# Altium project Embeded MCU.PrjPcb
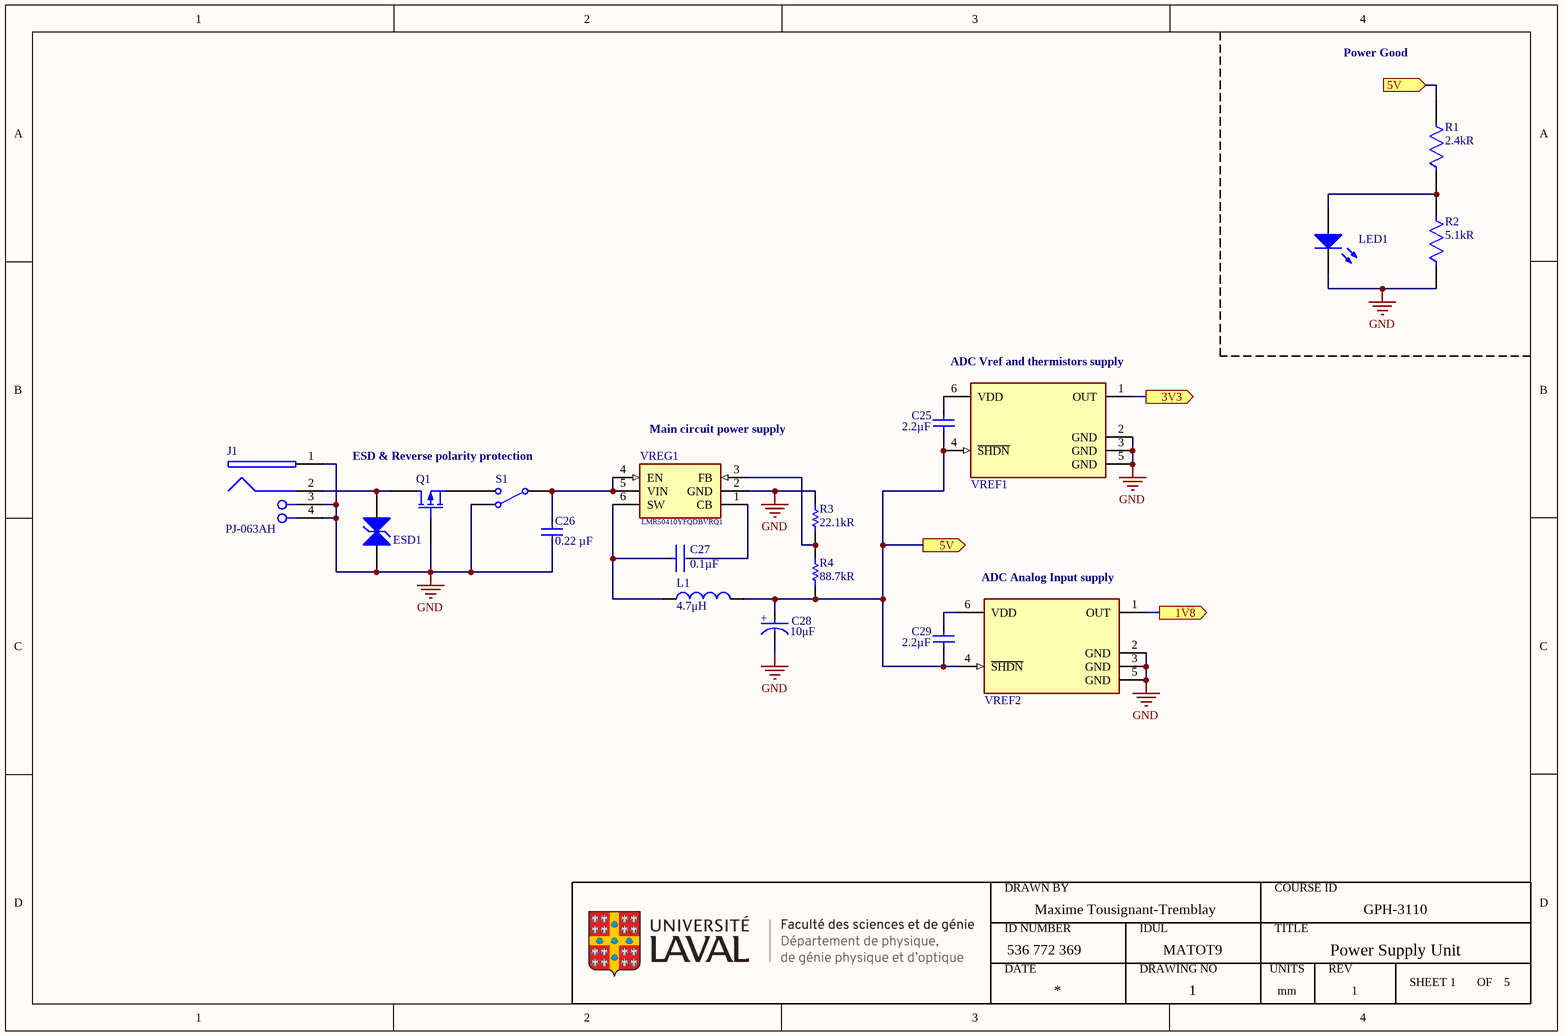
[diagram p0: Power Supply Unit.SchDoc]
Author: Maxime Tousignant-Tremblay; CAGE_CODE: ?????; CONTRACT_NUMBER: <CONTRACT NO>; CourseID: GPH-3110; DOC_NO_ASSY_DWG: <ASSY DWG NO>; DOC_NO_BOM: <BOM DOC NO>; DOC_NO_FAB_DWG: <FAB DWG NO>; DOC_NO_SCH_DWG: <SCH DWG NO>; DrawnBy: =Author; ID Number: 536 772 369; IDUL: MATOT9; PCB_2_DEC_TOL: +/-.01; PCB_3_DEC_TOL: +/-.010; PCB_ANG_TOL: +/-1/2; PCB_ASSEMBLY_NO: <PCB ASSY NO>; PCB_CHECKER: - -----; PCB_CHECKER_APP_DATE: --/--/----; PCB_DESIGNER: - -----; PCB_DESIGNER_APP_DATE: --/--/----; PCB_DWG_NO: <PCB DWG NO>; PCB_ENGINEER: - -----; PCB_ENGINEER_APP_DATE: --/--/----; PCB_PART_NUMBER: <PCB PN>; PCB_REV: A; Revision: 1; SCH_REV: A; Units: mm
5 sheets, 116 parts. Net scope: flat (ports and power ports of the same name join across sheets).
Board file: Embeded MCU.PcbDoc
Sheets:
  Power Supply Unit.SchDoc
  Wheatstone bridge part II.SchDoc
  Wheatstone bridge part I.SchDoc
  Wheatstone bridge part III.SchDoc
  Processing interface.SchDoc

## Sheet Power Supply Unit.SchDoc: Power Supply Unit
size A4; DrawnBy: Maxime Tousignant-Tremblay; DocumentNumber: GPH-3110-1; Revision: 1; SheetNumber: 1; SheetTotal: 5; SPICEModelCacheSEIOAEZJ: <root> / <DocumentId>SEIOAEZJ</DocumentId> / </root>

### Parts
*2  ULaval FSG-DPGPO  (value not drawn)  (graphical)
C25  Capacitance: 2.2µF  [CC0603KRX7R5BB225]  (hidden comment: CC0603KRX7R5BB225)
C26  0.22 µF  [GRM188R71E224KA88D]
C27  Capacitance: 0.1µF  [CAP 0603_1608]
C28  value 10μF  [293D106X9016B2TE3]  (hidden comment: 293D106X9016B2TE3)
C29  Capacitance: 2.2µF  [CC0603KRX7R5BB225]  (hidden comment: CC0603KRX7R5BB225)
ESD1  SMBJ20CA  [SMBJ20CA]  (value not drawn)
J1  PJ-063AH  [PJ-063AH]
L1  value 4.7μH  [ILSB1206ER4R7K]  (hidden comment: ILSB1206ER4R7K)
LED1  151053GS03000  [Type 5mm]  (value not drawn)
Q1  IRLML9303TRPBF  [IRLML9303TRPBF]  (value not drawn)
R1  value 2.4kR  [FP-AC0603-IPC_C]  (hidden comment: AC0603FR-072K4L)
R2  value 5.1kR  [FP-AC0603-IPC_C]  (hidden comment: AC0603FR-075K1L)
R3  value 22.1kR  [CRCW060322K1FKEA-Footprint-2]  (hidden comment: CRCW060322K1FKEA)
R4  value 88.7kR  [FP-CRCW0603-e3-IPC_B]  (hidden comment: CRCW060388K7FKEB)
S1  Single-Pole, Double-Throw Switch  (value not drawn)
VREF1  MCP1501T-33E/CHY  [MCP1501T-33E/CHY]  (value not drawn)
VREF2  MCP1501T-18E/CHY  [MCP1501T-18E/CHY]  (value not drawn)
VREG1  LMR50410YFQDBVRQ1  [LMR50410YFQDBVRQ1]

### Ports
1V8 (out), 3V3 (out), 5V (in), 5V (out)

### Nets
GND: C26.1 C28.1(C) ESD1.2 J1.1 J1.3(SHLD) J1.4(SHLD) LED1.1(K) Q1.2(G) R2.1 R3.2 S1.3 VREF1.2(GND) VREF1.3(GND) VREF1.5(GND) VREF2.2(GND) VREF2.3(GND) VREF2.5(GND) VREG1.2(GND)
NetADC1_1: VREF1.1(OUT) ; port 3V3
NetADC1_2: VREF2.1(OUT) ; port 1V8
NetADC1_9: C25.2 C28.2(A) C29.2 L1.2 R1.2 R4.1 VREF1.4(~{SHDN}) VREF2.4(~{SHDN}) ; port 5V
NetC25_1: C25.1 VREF1.6(VDD)
NetC26_2: C26.2 S1.1 VREG1.4(EN) VREG1.5(VIN)
NetC27_1: C27.1 L1.1 VREG1.6(SW)
NetC27_2: C27.2 VREG1.1(CB)
NetC29_1: C29.1 VREF2.6(VDD)
NetESD1_1: ESD1.1 J1.2 Q1.1(D)
NetLED1_2: LED1.2(A) R1.1 R2.2
NetQ1_3: Q1.3(S) S1.2
NetR3_1: R3.1 R4.2 VREG1.3(FB)

### Notes on the sheet
- Power Good
- (near VREF1) ADC Vref and thermistors supply
- (near VREG1) Main circuit power supply
- ESD & Reverse polarity protection
- (near VREF2) ADC Analog Input supply
- (in symbol 293D106X9016B2TE3) +
- (in symbol ULaval FSG-DPGPO) DRAWN BY; COURSE ID; ID NUMBER; IDUL; TITLE; DATE; DRAWING NO; UNITS; REV; SHEET; OF

### Library data of the parts
C25 C29 = CC0603KRX7R5BB225: 2.2 µF ±10% 6.3V Ceramic Capacitor X7R 0603 (1608 Metric); manufacturer: Yageo; Part Number: CC0603KRX7R5BB225; Applications: General Purpose; componentlink1description: Datasheet; componentlink1url: https://www.yageo.com/upload/media/product/productsearch/datasheet/mlcc/UPY-GPHC_X7R_6.3V-to-50V_18.pdf; componentlink2description: DigiKey Link; componentlink2url: https://www.digikey.com/en/products/detail/yageo/CC0603KRX7R5BB225/5195203; Device Package: 0603 (1608 Metric); lastupdated: 2023-03-06 20:08:32; Lifecycle Status: Active; Minimum Order: 1; Mounting Type: Surface Mount, MLCC; Operating Temperature: -55°C ~ 125°C; Package / Case: 0603 (1608 Metric); packaging: TapeAndReel; partid: 41539; Part Status: Active; price: 0.01; series: CC; Size / Dimension: 0.063" L x 0.031" W (1.60mm x 0.80mm); Temperature Coefficient: X7R; Thickness (Max): 0.035" (0.90mm); Tolerance: ±10%; Voltage - Rated: 6.3V; ComponentLink1Description: Datasheet; ComponentLink1URL: *; Supplier 1: Digi-Key; Supplier Part Number 1: 311-1795-1-ND; Supplier 2: Digi-Key; Supplier Part Number 2: 311-1795-6-ND; Supplier 3: Digi-Key; Supplier Part Number 3: 311-1795-2-ND
C26 = GRM188R71E224KA88D: 0.22 µF ±10% 25V Ceramic Capacitor X7R 0603 (1608 Metric); manufacturer: Murata Electronics; Part Number: GRM188R71E224KA88D; Applications: General Purpose; Capacitance: 0.22 µF; componentlink1description: Datasheet; componentlink1url: https://www.murata.com/~/media/webrenewal/support/library/catalog/products/capacitor/mlcc/c02e.ashx?la=en-us; componentlink2description: DigiKey Link; componentlink2url: https://www.digikey.com/en/products/detail/murata-electronics/GRM188R71E224KA88D/702554; Device Package: 0603 (1608 Metric); lastupdated: 2023-03-05 20:08:17; Lifecycle Status: Active; Minimum Order: 1; Mounting Type: Surface Mount, MLCC; Operating Temperature: -55°C ~ 125°C; Package / Case: 0603 (1608 Metric); packaging: TapeAndReel; partid: 11196; Part Status: Active; price: 0.01; series: GRM; Size / Dimension: 0.063" L x 0.031" W (1.60mm x 0.80mm); Temperature Coefficient: X7R; Thickness (Max): 0.035" (0.90mm); Tolerance: ±10%; Voltage - Rated: 25V; Supplier 1: Digi-Key; Supplier Part Number 1: 490-3290-1-ND; Supplier 2: Digi-Key; Supplier Part Number 2: 490-3290-6-ND; Supplier 3: Digi-Key; Supplier Part Number 3: 490-3290-2-ND; Value: 0.22 µF
C27 = CC0603JRX7R9BB104: 0.1 µF ±5% 50V Ceramic Capacitor X7R 0603 (1608 Metric); manufacturer: Yageo; Part Number: CC0603JRX7R9BB104; Applications: General Purpose; componentlink1description: Datasheet; componentlink1url: https://www.yageo.com/upload/media/product/productsearch/datasheet/mlcc/UPY-GPHC_X7R_6.3V-to-50V_18.pdf; componentlink2description: DigiKey Link; componentlink2url: https://www.digikey.com/en/products/detail/yageo/CC0603JRX7R9BB104/5195188; Device Package: 0603 (1608 Metric); lastupdated: 2023-03-06 20:08:09; Lifecycle Status: Active; Minimum Order: 1; Mounting Type: Surface Mount, MLCC; Operating Temperature: -55°C ~ 125°C; Package / Case: 0603 (1608 Metric); packaging: TapeAndReel; partid: 12474; Part Status: Active; price: 0.01; series: CC; Size / Dimension: 0.063" L x 0.031" W (1.60mm x 0.80mm); Supplier 1: DigiKey; Supplier Part Number 1: 311-1779-1-ND; Temperature Coefficient: X7R; Thickness (Max): 0.035" (0.90mm); Tolerance: ±5%; Voltage - Rated: 50V
C28 = 293D106X9016B2TE3: 10 µF Molded Tantalum Capacitors 16 V 1411 (3528 Metric) 2Ohm; Voltage Rating: 16V; Case Code (Imperial): 1411; Supplier 1: Digi-Key; Supplier Part Number 1: 718-1124-1-ND; Supplier 2: Digi-Key; Supplier Part Number 2: 718-1124-6-ND; Supplier 3: Digi-Key; Supplier Part Number 3: 718-1124-2-ND
ESD1 = SMBJ20CA: 32.4V Clamp 18.6A Ipp Tvs Diode Surface Mount SMB (DO-214AA); Max Power Dissipation: 600W; Diode Type: Zener; Element Configuration: Single; Reverse Standoff Voltage: 20V; Direction: Bidirectional; Max Breakdown Voltage: 25.5V; Min Breakdown Voltage: 22.2V; Max Surge Current: 100A; Peak Pulse Current: 18.6A; ComponentLink1Description: Datasheet; ComponentLink1URL: https://www.bourns.com/docs/Product-Datasheets/SMBJ.pdf; Supplier 1: Digi-Key; Supplier Part Number 1: SMBJ20CABCT-ND; Supplier 2: Digi-Key; Supplier Part Number 2: SMBJ20CABDKR-ND
J1 = PJ-063AH: Power Barrel Connector Jack 2.10mm ID (0.083"), 5.50mm OD (0.217") Through Hole, Right Angle; Current Rating: 8A; Shielding: Shielded; Voltage Rating: 24V; Insulation Resistance: 100MR; Number of Conductors: 2; Supplier 1: Digi-Key; Supplier Part Number 1: CP-063AH-ND; ComponentLink1Description: Datasheet; ComponentLink1URL: https://www.cuidevices.com/product/resource/pj-063ah.pdf; Max Operating Temperature: 85°C; Min Operating Temperature: -25°C; Contact Material: Copper; Contact Plating: Nickel; Flammability Rating: UL94 V-0
L1 = ILSB1206ER4R7K: 4.7 µH Shielded Multilayer Inductor 50 mA 900mOhm Max 1206 (3216 Metric); Tolerance: 10%; Core Material: Ferrite; Self Resonant Frequency: 41MHz; Supplier 1: Digi-Key; Supplier Part Number 1: 541-4372-1-ND; Supplier 2: Digi-Key; Supplier Part Number 2: 541-4372-6-ND; Supplier 3: Digi-Key; Supplier Part Number 3: 541-4372-2-ND; Case Code (Imperial): 1206; Min Operating Temperature: -55°C; Max Operating Temperature: 125°C; Width: 1.6mm; Depth: 1.8mm; Weight: 0.000353oz; ComponentLink1Description: Datasheet; ComponentLink1URL: https://www.vishay.com/docs/34029/ilsb1206.pdf
LED1 = CMP-007-00044-1: Led, Green, T-1 3/4 (5Mm), 522 Nm, 3.4 V, 30 Ma, 10 Cd Rohs Compliant: Yes; Lens Style: Round,Domed,Circular; Viewing Angle: 30°; Lens Transparency: Clear; Luminous Intensity: 10000mcd; Forward Voltage: 3.4V; Dominant Wavelength: 522nm; Forward Current: 30mA; Test Current: 20mA; Lens Color: Colorless; Package Quantity: 1; Height: 8.85mm; RoHS Compliant: Yes; Max Operating Temperature: 85°C; Packaging: Bulk; Wavelength: 522nm; Lens Size: 5mm; Color: Green; Mounting Technology: Through Hole; Series: WL-TMRW; Case/Package: Radial; Min Operating Temperature: -40°C
Q1 = IRLML9303TRPBF: P-Channel 30 V 2.3A (Ta) 1.25W (Ta) Surface Mount Micro3™/SOT-23; Manufacturer: Infineon Technologies; Drain to Source Voltage (Vdss): 30 V; Drive Voltage (Max Rds On,  Min Rds On): 4.5V, 10V; Gate Charge (Qg) (Max) @ Vgs: 2 nC @ 4.5 V; Input Capacitance (Ciss) (Max) @ Vds: 160 pF @ 25 V; Rds On (Max) @ Id, Vgs: 165mOhm @ 2.3A, 10V; Vgs (Max): ±20V; Vgs(th) (Max) @ Id: 2.4V @ 10µA; Part Number: IRLML9303TRPBF; ComponentLink1Description: Datasheet; ComponentLink1URL: https://www.infineon.com/dgdl/irlml9303pbf.pdf?fileId=5546d462533600a401535668ef1d2642; ComponentLink2Description: DigiKey Link; ComponentLink2URL: https://www.digikey.com/en/products/detail/infineon-technologies/IRLML9303TRPBF/2354147; Current - Continuous Drain (Id) @ 25°C: 2.3A (Ta); FET Type: P-Channel; LastUpdated: 2023-03-05 21:05:43; Lifecycle Status: Active; Minimum Order: 1; Mounting Type: Surface Mount; Operating Temperature: -55°C ~ 150°C (TJ); Package / Case: TO-236-3, SC-59, SOT-23-3; Packaging: TapeAndReel; Part Status: Active; Power Dissipation (Max): 1.25W (Ta); Price: 0.11; Series: HEXFET®; Supplier Device Package: Micro3™/SOT-23; Technology: MOSFET (Metal Oxide); Supplier 1: Digi-Key; Supplier Part Number 1: IRLML9303TRPBFCT-ND; Supplier 2: Digi-Key; Supplier Part Number 2: IRLML9303TRPBFDKR-ND; Supplier 3: Digi-Key; Supplier Part Number 3: IRLML9303TRPBFTR-ND
R1 = CMP-009-00195-2: Res Thick Film 0603 2.4K Ohm 1% 0.1W(1/10W) ±100ppm/C Pad SMD Automotive T/R; Power Rating: 100mW; Voltage Rating: 50V; Temperature Coefficient: 100ppm/°C; Termination: SMD/SMT; Case Code (Metric): 1608; Number of Terminations: 2; Min Operating Temperature: -55°C; Width: 0.8mm; Length: 0.063inch; Tolerance: 1%; Height: 0.022inch; Case Code (Imperial): 0603; Max Operating Temperature: 155°C; Weight: 7.1E-05oz; Packaging: Tape and Reel; Resistor Type: Thick Film; Case/Package: 0603; Ratings: AEC-Q200; RoHS Compliant: Yes; Features: Moisture Resistant,Automotive AEC-Q200; Max Power Dissipation: 100mW; Series: AC
R2 = CMP-009-00196-1: Res Thick Film 0603 5.1K Ohm 1% 1/10W ±100ppm/°C Molded SMD Paper T/R; Voltage Rating: 50V; Power Rating: 100mW; Case/Package: 0603; Case Code (Imperial): 0603; Ratings: AEC-Q200; Width: 0.8mm; Tolerance: 1%; Max Operating Temperature: 155°C; Number of Terminations: 2; Case Code (Metric): 1608; Resistor Type: Thick Film; Packaging: Tape and Reel; RoHS Compliant: Yes; Min Operating Temperature: -55°C; Height: 0.45mm; Series: AC; Max Power Dissipation: 100mW; Weight: 7.1E-05oz; Features: Moisture Resistant,Automotive AEC-Q200; Termination: SMD/SMT; Length: 1.6mm; Temperature Coefficient: 100ppm/°C
R3 = CMP-009-00200-2: Res Thick Film 0603 22.1K Ohm 1% 1/10W ±100ppm/°C Molded SMD SMD Paper T/R; Voltage Rating (DC): 75V; Max Power Dissipation: 100mW; Number of Terminations: 2; Tolerance: 1%; Construction: Rectangular; Packaging: Tape and Reel; Case Code (Imperial): 0603; Termination: SMD/SMT; Series: CRCW; Temperature Coefficient: 100ppm/°C; Depth: 0.85mm; Military Standard: Not; Height: 0.45mm; Weight: 7.1E-05oz; Package Quantity: 10; Radiation Hardening: No; Width: 0.033inch; Case Code (Metric): 1608; Mounting Technology: Surface Mount; Min Operating Temperature: -55°C; Voltage Rating: 75V; RoHS Compliant: Yes; Case/Package: 0603; Max Operating Temperature: 155°C; Lead Free: Lead Free; Contact Plating: Tin; Resistance Tolerance: 1%; Resistor Type: Thick Film; Power Rating: 100mW; Ratings: AEC-Q200; Features: Automotive AEC-Q200; Technology: THICK FILM; Length: 1.55mm
R4 = CMP-009-00199-2: D11/CRCW0603 100 88K7 1% ET5 e3; Max Power Dissipation: 100mW; Voltage Rating: 75V; Temperature Coefficient: 100ppm/°C; RoHS Compliant: Yes; Min Operating Temperature: -55°C; Packaging: Tape and Reel; Weight: 7.1E-05oz; Military Standard: Not; Case Code (Metric): 1608; Tolerance: 1%; Power Rating: 100mW; Resistor Type: Thick Film; Features: Automotive AEC-Q200; Construction: Rectangular; Length: 0.061inch; Case/Package: 0603; Number of Terminations: 2; Lead Free: Lead Free; Width: 0.85mm; Max Operating Temperature: 155°C; Package Quantity: 10000; Height: 0.02inch; Depth: 0.85mm; Termination: SMD/SMT; Case Code (Imperial): 0603; Series: CRCW
S1 = SPDT SW: nodeUP_closed: 1; Rclosed: 1m; Ropen: 1Meg; SimulationGenericComponent: True
VREF1 = MCP1501T-33E/CHY: Series Voltage Reference IC Fixed 3.3V V ±0.1% 20 mA SOT-23-6; Temperature Coefficient: 50ppm/°C; Output Current: 20mA; Tolerance: 0.08%; Operating Supply Current: 550μA; ComponentLink1Description: New link; ComponentLink1URL: *; Reference Type: Series; Case/Package: SOT-23-6; Output Type: Fixed; Min Output Voltage: 3.3V; Min Operating Temperature: -40°C; Max Operating Temperature: 125°C; Supplier 1: Digi-Key; Supplier Part Number 1: MCP1501T-33E/CHYCT-ND; Supplier 2: Digi-Key; Supplier Part Number 2: MCP1501T-33E/CHYDKR-ND; Supplier 3: Digi-Key; Supplier Part Number 3: MCP1501T-33E/CHYTR-ND
VREF2 = MCP1501T-18E/CHY: Series Voltage Reference IC Fixed 31.8V V ±0.1% 20 mA SOT-23-6; Temperature Coefficient: 50ppm/°C; Output Current: 20mA; Min Output Voltage: 1.8V; Tolerance: 0.08%; Operating Supply Current: 550μA; ComponentLink1Description: New link; ComponentLink1URL: *; Reference Type: Series; Case/Package: SOT-23-6; Output Type: Fixed; Min Operating Temperature: -40°C; Max Operating Temperature: 125°C; Supplier 1: Digi-Key; Supplier Part Number 1: MCP1501T-18E/CHYCT-ND; Supplier 2: Digi-Key; Supplier Part Number 2: MCP1501T-18E/CHYDKR-ND
VREG1 = LMR50410YFQDBVRQ1: Buck Switching Regulator IC Positive Adjustable 1V 1 Output 1A SOT-23-6; Manufacturer_Name: Texas Instruments; Datasheet Link: https://www.ti.com/product/LMR50410-Q1; Height: 1.45mm; Manufacturer_Part_Number: LMR50410YFQDBVRQ1; Mouser Part Number: 595-MR50410YFQDBVRQ1; Mouser Price/Stock: https://www.mouser.co.uk/ProductDetail/Texas-Instruments/LMR50410YFQDBVRQ1?qs=81r%252BiQLm7BRUAgUFqYZycA%3D%3D; Arrow Part Number: LMR50410YFQDBVRQ1; Arrow Price/Stock: https://www.arrow.com/en/products/lmr50410yfqdbvrq1/texas-instruments?region=nac; Supplier 1: Digi-Key; Supplier Part Number 1: 296-LMR50410YFQDBVRQ1CT-ND; Supplier 2: Digi-Key; Supplier Part Number 2: 296-LMR50410YFQDBVRQ1DKR-ND; Supplier 3: Digi-Key; Supplier Part Number 3: 296-LMR50410YFQDBVRQ1TR-ND

## Sheet Wheatstone bridge part II.SchDoc: Wheatstone bridge part II
size A4; Revision: 1; SheetNumber: 2; SheetTotal: 5
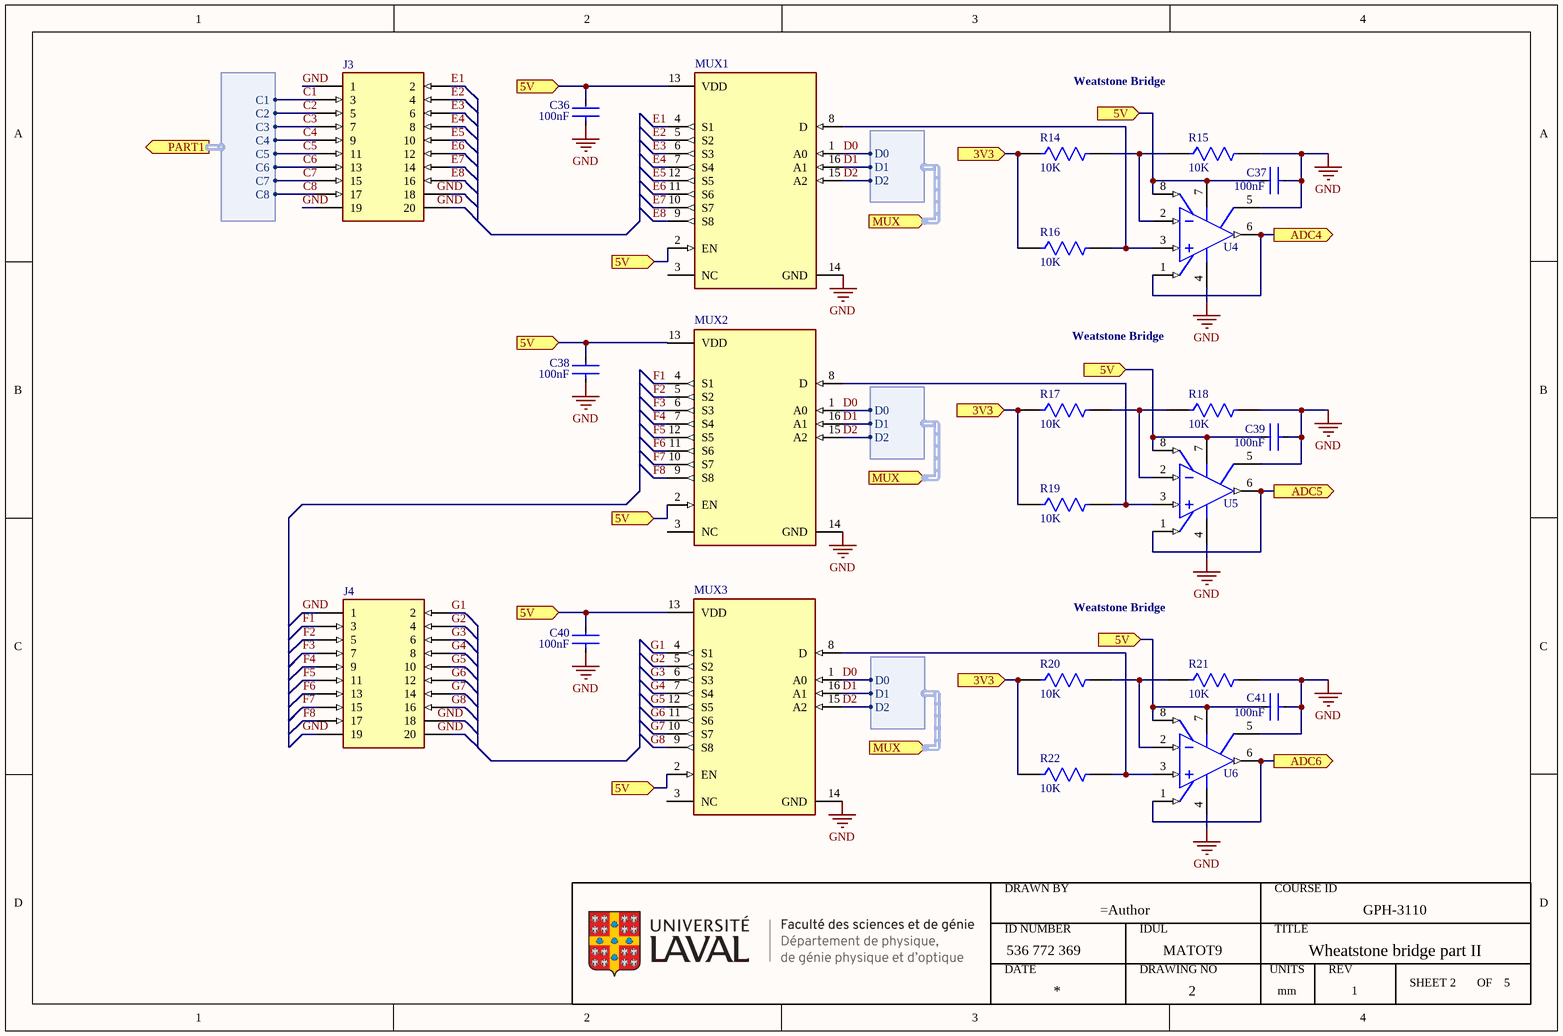
[diagram p1: Wheatstone bridge part II.SchDoc]

### Parts
*4  ULaval FSG-DPGPO  (value not drawn)  (graphical)
C36  value 100nF  [FP-CC0603-DA-IPC_B]  (hidden comment: CC0603JRX7R9BB104)
C37  value 100nF  [FP-CC0603-DA-IPC_B]  (hidden comment: CC0603JRX7R9BB104)
C38  value 100nF  [FP-CC0603-DA-IPC_B]  (hidden comment: CC0603JRX7R9BB104)
C39  value 100nF  [FP-CC0603-DA-IPC_B]  (hidden comment: CC0603JRX7R9BB104)
C40  value 100nF  [FP-CC0603-DA-IPC_B]  (hidden comment: CC0603JRX7R9BB104)
C41  value 100nF  [FP-CC0603-DA-IPC_B]  (hidden comment: CC0603JRX7R9BB104)
J3  SFC-110-T1-F-D-A  [SFC-110-T1-F-D-A-Footprint-2]  (value not drawn)
J4  SFC-110-T1-F-D-A  [SFC-110-T1-F-D-A-Footprint-2]  (value not drawn)
MUX1  TMUX1208PWR  [TMUX1208PWR]  (value not drawn)
MUX2  TMUX1208PWR  [TMUX1208PWR]  (value not drawn)
MUX3  TMUX1208PWR  [TMUX1208PWR]  (value not drawn)
R14  value 10K  [FP-RT0603-IPC_B]  (hidden comment: RT0603BRD0710KL)
R15  value 10K  [FP-RT0603-IPC_B]  (hidden comment: RT0603BRD0710KL)
R16  value 10K  [FP-RT0603-IPC_B]  (hidden comment: RT0603BRD0710KL)
R17  value 10K  [FP-RT0603-IPC_B]  (hidden comment: RT0603BRD0710KL)
R18  value 10K  [FP-RT0603-IPC_B]  (hidden comment: RT0603BRD0710KL)
R19  value 10K  [FP-RT0603-IPC_B]  (hidden comment: RT0603BRD0710KL)
R20  value 10K  [FP-RT0603-IPC_B]  (hidden comment: RT0603BRD0710KL)
R21  value 10K  [FP-RT0603-IPC_B]  (hidden comment: RT0603BRD0710KL)
R22  value 10K  [FP-RT0603-IPC_B]  (hidden comment: RT0603BRD0710KL)
U4  MCP6N11-100E/SN  [MCP6N11-100E/SN]  (value not drawn)
U5  MCP6N11-100E/SN  [MCP6N11-100E/SN]  (value not drawn)
U6  MCP6N11-100E/SN  [MCP6N11-100E/SN]  (value not drawn)

### Ports
3V3 (in), 5V (in), ADC4 (out), ADC5 (out), ADC6 (out), MUX (in, harness *), PART1 (out, harness J3)

### Harnesses
*: D0, D1, D2
J3: C1, C2, C3, C4, C5, C6, C7, C8

### Nets
GND: C36.1 C37.1 C38.1 C39.1 C40.1 C41.1 J3.1 J3.18 J3.19 J3.20 J4.1 J4.18 J4.19 J4.20 MUX1.14(GND) MUX2.14(GND) MUX3.14(GND) R15.2 R18.2 R21.2 U4.4(VSS) U4.5(VREF) U5.4(VSS) U5.5(VREF) U6.4(VSS) U6.5(VREF)
C1: J3.3 ; port PART1.C1
C2: J3.5 ; port PART1.C2
C3: J3.7 ; port PART1.C3
C4: J3.9 ; port PART1.C4
C5: J3.11 ; port PART1.C5
C6: J3.13 ; port PART1.C6
C7: J3.15 ; port PART1.C7
C8: J3.17 ; port PART1.C8
D0: MUX1.1(A0) MUX2.1(A0) MUX3.1(A0) ; port MUX.D0
D1: MUX1.16(A1) MUX2.16(A1) MUX3.16(A1) ; port MUX.D1
D2: MUX1.15(A2) MUX2.15(A2) MUX3.15(A2) ; port MUX.D2
E1: J3.2 MUX1.4(S1)
E2: J3.4 MUX1.5(S2)
E3: J3.6 MUX1.6(S3)
E4: J3.8 MUX1.7(S4)
E5: J3.10 MUX1.12(S5)
E6: J3.12 MUX1.11(S6)
E7: J3.14 MUX1.10(S7)
E8: J3.16 MUX1.9(S8)
F1: J4.3 MUX2.4(S1)
F2: J4.5 MUX2.5(S2)
F3: J4.7 MUX2.6(S3)
F4: J4.9 MUX2.7(S4)
F5: J4.11 MUX2.12(S5)
F6: J4.13 MUX2.11(S6)
F7: J4.15 MUX2.10(S7)
F8: J4.17 MUX2.9(S8)
G1: J4.2 MUX3.4(S1)
G2: J4.4 MUX3.5(S2)
G3: J4.6 MUX3.6(S3)
G4: J4.8 MUX3.7(S4)
G5: J4.10 MUX3.12(S5)
G6: J4.12 MUX3.11(S6)
G7: J4.14 MUX3.10(S7)
G8: J4.16 MUX3.9(S8)
NetADC1_1: R14.1 R16.1 R17.1 R19.1 R20.1 R22.1 ; port 3V3
NetADC1_9: C36.2 C37.2 C38.2 C39.2 C40.2 C41.2 MUX1.2(EN) MUX1.13(VDD) MUX2.2(EN) MUX2.13(VDD) MUX3.2(EN) MUX3.13(VDD) U4.7(VDD) U4.8(EN/~{CAL}) U5.7(VDD) U5.8(EN/~{CAL}) U6.7(VDD) U6.8(EN/~{CAL}) ; port 5V
NetADC4_3: U4.1(VFG) U4.6(VOUT) ; port ADC4
NetADC5_3: U5.1(VFG) U5.6(VOUT) ; port ADC5
NetADC6_3: U6.1(VFG) U6.6(VOUT) ; port ADC6
NetMUX1_8: MUX1.8(D) R16.2 U4.3(VIP)
NetMUX2_8: MUX2.8(D) R19.2 U5.3(VIP)
NetMUX3_8: MUX3.8(D) R22.2 U6.3(VIP)
NetR14_2: R14.2 R15.1 U4.2(VIM)
NetR17_2: R17.2 R18.1 U5.2(VIM)
NetR20_2: R20.2 R21.1 U6.2(VIM)

Not connected (* = marked no-connect by the designer): MUX1 3(NC); MUX2 3(NC); MUX3 3(NC)

### Notes on the sheet
- Weatstone Bridge
- (in symbol ULaval FSG-DPGPO) DRAWN BY; COURSE ID; ID NUMBER; IDUL; TITLE; DATE; DRAWING NO; UNITS; REV; SHEET; OF

### Library data of the parts
C36-C41 = CMP-001-00097-1: 0603 0.1 uF 50 V ±5 % Tolerance X7R SMT Multilayer Ceramic Capacitor; Voltage Rating: 50V; Tolerance: 5%; Halogen Free: Halogen Free; Depth: 0.8mm; Case/Package: 0603; Dielectric: X7R; Thickness: 0.035inch; Series: CC; Termination: SMD/SMT; Voltage Rating (DC): 50V; Max Operating Temperature: 125°C; Weight: 7.1E-05oz; Construction: Flat; Resistor Type: Ceramic; Height: 0.8mm; Length: 0.063inch; RoHS Compliant: Yes; Lead Free: Lead Free; Pins: 2; Min Operating Temperature: -55°C; Case Code (Imperial): 0603; Radiation Hardening: No; Case Code (Metric): 1608; Mounting Technology: Surface Mount; Width: 0.031inch; Packaging: Tape and Reel
J3 J4 = CMP-002-00080-2: Headers & Wire Housings .050 Tiger Eye Cost-Effective Reliable Socket Strip; Pitch: 0.05inch; Voltage Rating (AC): 350V; Connector Type: Receptacle; Number of Contacts: 20; Gender: Female; Insulation Color: Black; Max Operating Temperature: 125°C; Min Operating Temperature: -55°C; Insulation Material: Polymer; RoHS Compliant: Yes; Row Spacing: 0.05inch; Number of Rows: 2; Contact Shape: Square; Contact Type: Female Socket; Mounting Technology: Through Hole; Termination: Solder; Fastening Type: Pull; Contact Finish - Mating: GOLD; Color: Black; Packaging: Rail/Tube; Contact Material: Bronze; Contact Plating: Gold; Number of Positions: 20; Series: Tiger Eye™ SFC
MUX1-MUX3 = TMUX1208PWR: 5-V, 8: 1, 1-channel general-purpose analog multiplexer with 1.8-V input logic 16-TSSOP -40 to 125; Supplier 1: Digi-Key; Supplier Part Number 1: 296-51847-1-ND; Supplier 2: Digi-Key; Supplier Part Number 2: 296-51847-6-ND; Supplier 3: Digi-Key; Supplier Part Number 3: 296-51847-2-ND; ComponentLink1Description: Datasheet; ComponentLink1URL: https://www.ti.com/lit/ds/symlink/tmux1208.pdf?HQS=dis-dk-null-digikeymode-dsf-pf-null-wwe&ts=1678139087624&ref_url=https%253A%252F%252Fwww.ti.com%252Fgeneral%252Fdocs%252Fsuppproductinfo.tsp%253FdistId%253D10%2526gotoUrl%253Dhttps%253A%252F%252Fwww.ti.com%252Flit%252Fgpn%252Ftmux1208
R14-R22 = CMP-009-00178-1: Res High precision Thin Film 0603 10K Ohm 0.1% 1/10W ±25ppm/°C Molded SMD Paper T/R; Max Power Dissipation: 100mW; Working Voltage: 75V; RoHS Compliant: Yes; Power Rating: 100mW; Lead Free: Lead Free; Depth: 0.8mm; Case Code (Imperial): 0603; Max Operating Temperature: 155°C; Voltage Rating: 75V; Package Quantity: 5000; Packaging: Tape and Reel; Case/Package: 0603; Height: 0.022inch; Construction: Rectangular; Min Operating Temperature: -55°C; Termination: SMD/SMT; Features: Moisture Resistant; Number of Terminations: 2; Case Code (Metric): 1608; Technology: THIN FILM; Military Standard: Not; Length: 0.063inch; Voltage Rating (DC): 75V; Temperature Coefficient: 25ppm/°C; Weight: 7.1E-05oz; Width: 0.8mm; Series: RT; Resistor Type: Thin Film
U4-U6 = CMP-014-00010-7: MCP6N11 Series Single Channel 500 KHz 5.5 V Instrumentation Amplifier - SOIC-8; Bandwidth: 500kHz; Min Supply Voltage: 1.8V; Number of Elements: 2; Gain Bandwidth Product: 35MHz; Input Offset Voltage (Vos): 350uV; Number of Channels: 1; Nominal Supply Current: 800uA; Common Mode Rejection Ratio: 86dB; Slew Rate: 6V/µs; Max Supply Voltage: 5.5V; Slew Rate-Nom: 9V/µs; Input Bias Current: 10pA; Mounting Technology: Surface Mount; Package Quantity: 100; Pins: 8; Width: 3.9mm; Length: 4.9mm; Case/Package: SOIC; Min Operating Temperature: -40°C; Radiation Hardening: No; RoHS Compliant: Yes; Unity Gain Bandwidth Product: 35MHz; Lead Free: Lead Free; Number of Amplifiers: 1; Max Operating Temperature: 125°C; Height: 1.25mm; Packaging: Rail/Tube; Input Offset Voltage-Max: 350uV; Reach SVHC Compliant: Yes; Supply Current: 800uA; Max Supply Current: 800uA; Power Supply Rejection Ratio (PSRR): 86dB; Number of Circuits: 1

## Sheet Wheatstone bridge part I.SchDoc: Wheatstone bridge part I
size A4; Revision: 1; SheetNumber: 3; SheetTotal: 5
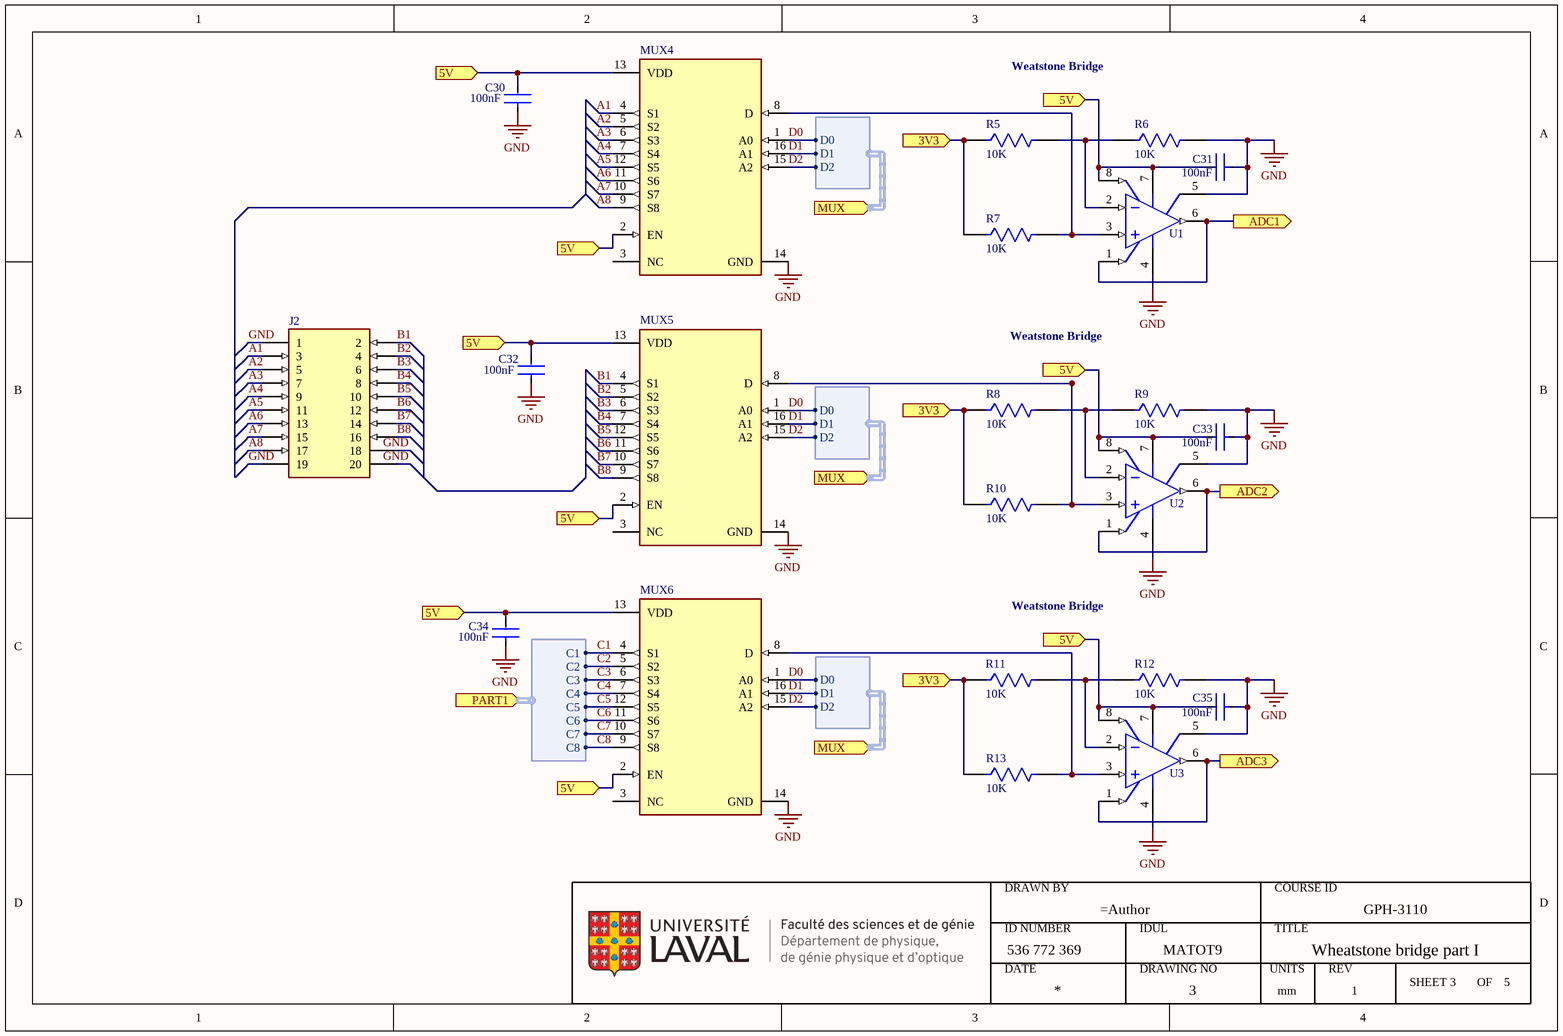
[diagram p2: Wheatstone bridge part I.SchDoc]

### Parts
*3  ULaval FSG-DPGPO  (value not drawn)  (graphical)
C30  value 100nF  [FP-CC0603-DA-IPC_B]  (hidden comment: CC0603JRX7R9BB104)
C31  value 100nF  [FP-CC0603-DA-IPC_B]  (hidden comment: CC0603JRX7R9BB104)
C32  value 100nF  [FP-CC0603-DA-IPC_B]  (hidden comment: CC0603JRX7R9BB104)
C33  value 100nF  [FP-CC0603-DA-IPC_B]  (hidden comment: CC0603JRX7R9BB104)
C34  value 100nF  [FP-CC0603-DA-IPC_B]  (hidden comment: CC0603JRX7R9BB104)
C35  value 100nF  [FP-CC0603-DA-IPC_B]  (hidden comment: CC0603JRX7R9BB104)
J2  SFC-110-T1-F-D-A  [SFC-110-T1-F-D-A-Footprint-2]  (value not drawn)
MUX4  TMUX1208PWR  [TMUX1208PWR]  (value not drawn)
MUX5  TMUX1208PWR  [TMUX1208PWR]  (value not drawn)
MUX6  TMUX1208PWR  [TMUX1208PWR]  (value not drawn)
R5  value 10K  [FP-RT0603-IPC_B]  (hidden comment: RT0603BRD0710KL)
R6  value 10K  [FP-RT0603-IPC_B]  (hidden comment: RT0603BRD0710KL)
R7  value 10K  [FP-RT0603-IPC_B]  (hidden comment: RT0603BRD0710KL)
R8  value 10K  [FP-RT0603-IPC_B]  (hidden comment: RT0603BRD0710KL)
R9  value 10K  [FP-RT0603-IPC_B]  (hidden comment: RT0603BRD0710KL)
R10  value 10K  [FP-RT0603-IPC_B]  (hidden comment: RT0603BRD0710KL)
R11  value 10K  [FP-RT0603-IPC_B]  (hidden comment: RT0603BRD0710KL)
R12  value 10K  [FP-RT0603-IPC_B]  (hidden comment: RT0603BRD0710KL)
R13  value 10K  [FP-RT0603-IPC_B]  (hidden comment: RT0603BRD0710KL)
U1  MCP6N11-100E/SN  [MCP6N11-100E/SN]  (value not drawn)
U2  MCP6N11-100E/SN  [MCP6N11-100E/SN]  (value not drawn)
U3  MCP6N11-100E/SN  [MCP6N11-100E/SN]  (value not drawn)

### Ports
3V3 (in), 5V (in), ADC1 (out), ADC2 (out), ADC3 (out), MUX (in, harness *), PART1 (in, harness J2)

### Harnesses
*: D0, D1, D2
J2: C1, C2, C3, C4, C5, C6, C7, C8

### Nets
GND: C30.1 C31.1 C32.1 C33.1 C34.1 C35.1 J2.1 J2.18 J2.19 J2.20 MUX4.14(GND) MUX5.14(GND) MUX6.14(GND) R6.2 R9.2 R12.2 U1.4(VSS) U1.5(VREF) U2.4(VSS) U2.5(VREF) U3.4(VSS) U3.5(VREF)
A1: J2.3 MUX4.4(S1)
A2: J2.5 MUX4.5(S2)
A3: J2.7 MUX4.6(S3)
A4: J2.9 MUX4.7(S4)
A5: J2.11 MUX4.12(S5)
A6: J2.13 MUX4.11(S6)
A7: J2.15 MUX4.10(S7)
A8: J2.17 MUX4.9(S8)
B1: J2.2 MUX5.4(S1)
B2: J2.4 MUX5.5(S2)
B3: J2.6 MUX5.6(S3)
B4: J2.8 MUX5.7(S4)
B5: J2.10 MUX5.12(S5)
B6: J2.12 MUX5.11(S6)
B7: J2.14 MUX5.10(S7)
B8: J2.16 MUX5.9(S8)
C1: MUX6.4(S1) ; port PART1.C1
C2: MUX6.5(S2) ; port PART1.C2
C3: MUX6.6(S3) ; port PART1.C3
C4: MUX6.7(S4) ; port PART1.C4
C5: MUX6.12(S5) ; port PART1.C5
C6: MUX6.11(S6) ; port PART1.C6
C7: MUX6.10(S7) ; port PART1.C7
C8: MUX6.9(S8) ; port PART1.C8
D0: MUX4.1(A0) MUX5.1(A0) MUX6.1(A0) ; port MUX.D0
D1: MUX4.16(A1) MUX5.16(A1) MUX6.16(A1) ; port MUX.D1
D2: MUX4.15(A2) MUX5.15(A2) MUX6.15(A2) ; port MUX.D2
NetADC1_1: R5.1 R7.1 R8.1 R10.1 R11.1 R13.1 ; port 3V3
NetADC1_3: U1.1(VFG) U1.6(VOUT) ; port ADC1
NetADC1_9: C30.2 C31.2 C32.2 C33.2 C34.2 C35.2 MUX4.2(EN) MUX4.13(VDD) MUX5.2(EN) MUX5.13(VDD) MUX6.2(EN) MUX6.13(VDD) U1.7(VDD) U1.8(EN/~{CAL}) U2.7(VDD) U2.8(EN/~{CAL}) U3.7(VDD) U3.8(EN/~{CAL}) ; port 5V
NetADC2_3: U2.1(VFG) U2.6(VOUT) ; port ADC2
NetADC3_3: U3.1(VFG) U3.6(VOUT) ; port ADC3
NetMUX4_8: MUX4.8(D) R7.2 U1.3(VIP)
NetMUX5_8: MUX5.8(D) R10.2 U2.3(VIP)
NetMUX6_8: MUX6.8(D) R13.2 U3.3(VIP)
NetR5_2: R5.2 R6.1 U1.2(VIM)
NetR8_2: R8.2 R9.1 U2.2(VIM)
NetR11_2: R11.2 R12.1 U3.2(VIM)

Not connected (* = marked no-connect by the designer): MUX4 3(NC); MUX5 3(NC); MUX6 3(NC)

### Notes on the sheet
- Weatstone Bridge
- (in symbol ULaval FSG-DPGPO) DRAWN BY; COURSE ID; ID NUMBER; IDUL; TITLE; DATE; DRAWING NO; UNITS; REV; SHEET; OF

### Library data of the parts
C30-C35 = CMP-001-00097-1: as C36 on sheet Wheatstone bridge part II; Halogen Free: Halogen Free; Depth: 0.8mm; Case/Package: 0603; Dielectric: X7R; Thickness: 0.035inch; Series: CC; Termination: SMD/SMT; Voltage Rating (DC): 50V; Max Operating Temperature: 125°C; Weight: 7.1E-05oz; Construction: Flat; Resistor Type: Ceramic; Height: 0.8mm; Length: 0.063inch; RoHS Compliant: Yes; Lead Free: Lead Free; Pins: 2; Min Operating Temperature: -55°C; Case Code (Imperial): 0603; Radiation Hardening: No; Case Code (Metric): 1608; Mounting Technology: Surface Mount; Width: 0.031inch; Packaging: Tape and Reel
J2 = CMP-002-00080-2: as J3 on sheet Wheatstone bridge part II; Insulation Color: Black; Max Operating Temperature: 125°C; Min Operating Temperature: -55°C; Insulation Material: Polymer; RoHS Compliant: Yes; Row Spacing: 0.05inch; Number of Rows: 2; Contact Shape: Square; Contact Type: Female Socket; Mounting Technology: Through Hole; Termination: Solder; Fastening Type: Pull; Contact Finish - Mating: GOLD; Color: Black; Packaging: Rail/Tube; Contact Material: Bronze; Contact Plating: Gold; Number of Positions: 20; Series: Tiger Eye™ SFC
MUX4-MUX6 = TMUX1208PWR: as MUX1 on sheet Wheatstone bridge part II; Supplier 1: Digi-Key; Supplier Part Number 1: 296-51847-1-ND; Supplier 2: Digi-Key; Supplier Part Number 2: 296-51847-6-ND; Supplier 3: Digi-Key; Supplier Part Number 3: 296-51847-2-ND; ComponentLink1Description: Datasheet; ComponentLink1URL: https://www.ti.com/lit/ds/symlink/tmux1208.pdf?HQS=dis-dk-null-digikeymode-dsf-pf-null-wwe&ts=1678139087624&ref_url=https%253A%252F%252Fwww.ti.com%252Fgeneral%252Fdocs%252Fsuppproductinfo.tsp%253FdistId%253D10%2526gotoUrl%253Dhttps%253A%252F%252Fwww.ti.com%252Flit%252Fgpn%252Ftmux1208
R5-R13 = CMP-009-00178-1: as R14 on sheet Wheatstone bridge part II; RoHS Compliant: Yes; Power Rating: 100mW; Lead Free: Lead Free; Depth: 0.8mm; Case Code (Imperial): 0603; Max Operating Temperature: 155°C; Voltage Rating: 75V; Package Quantity: 5000; Packaging: Tape and Reel; Case/Package: 0603; Height: 0.022inch; Construction: Rectangular; Min Operating Temperature: -55°C; Termination: SMD/SMT; Features: Moisture Resistant; Number of Terminations: 2; Case Code (Metric): 1608; Technology: THIN FILM; Military Standard: Not; Length: 0.063inch; Voltage Rating (DC): 75V; Temperature Coefficient: 25ppm/°C; Weight: 7.1E-05oz; Width: 0.8mm; Series: RT; Resistor Type: Thin Film
U1-U3 = CMP-014-00010-7: as U4 on sheet Wheatstone bridge part II; Mounting Technology: Surface Mount; Package Quantity: 100; Pins: 8; Width: 3.9mm; Length: 4.9mm; Case/Package: SOIC; Min Operating Temperature: -40°C; Radiation Hardening: No; RoHS Compliant: Yes; Unity Gain Bandwidth Product: 35MHz; Lead Free: Lead Free; Number of Amplifiers: 1; Max Operating Temperature: 125°C; Height: 1.25mm; Packaging: Rail/Tube; Input Offset Voltage-Max: 350uV; Reach SVHC Compliant: Yes; Supply Current: 800uA; Max Supply Current: 800uA; Power Supply Rejection Ratio (PSRR): 86dB; Number of Circuits: 1

## Sheet Wheatstone bridge part III.SchDoc: Wheatstone bridge part III
size A4; SheetNumber: 4; SheetTotal: 5
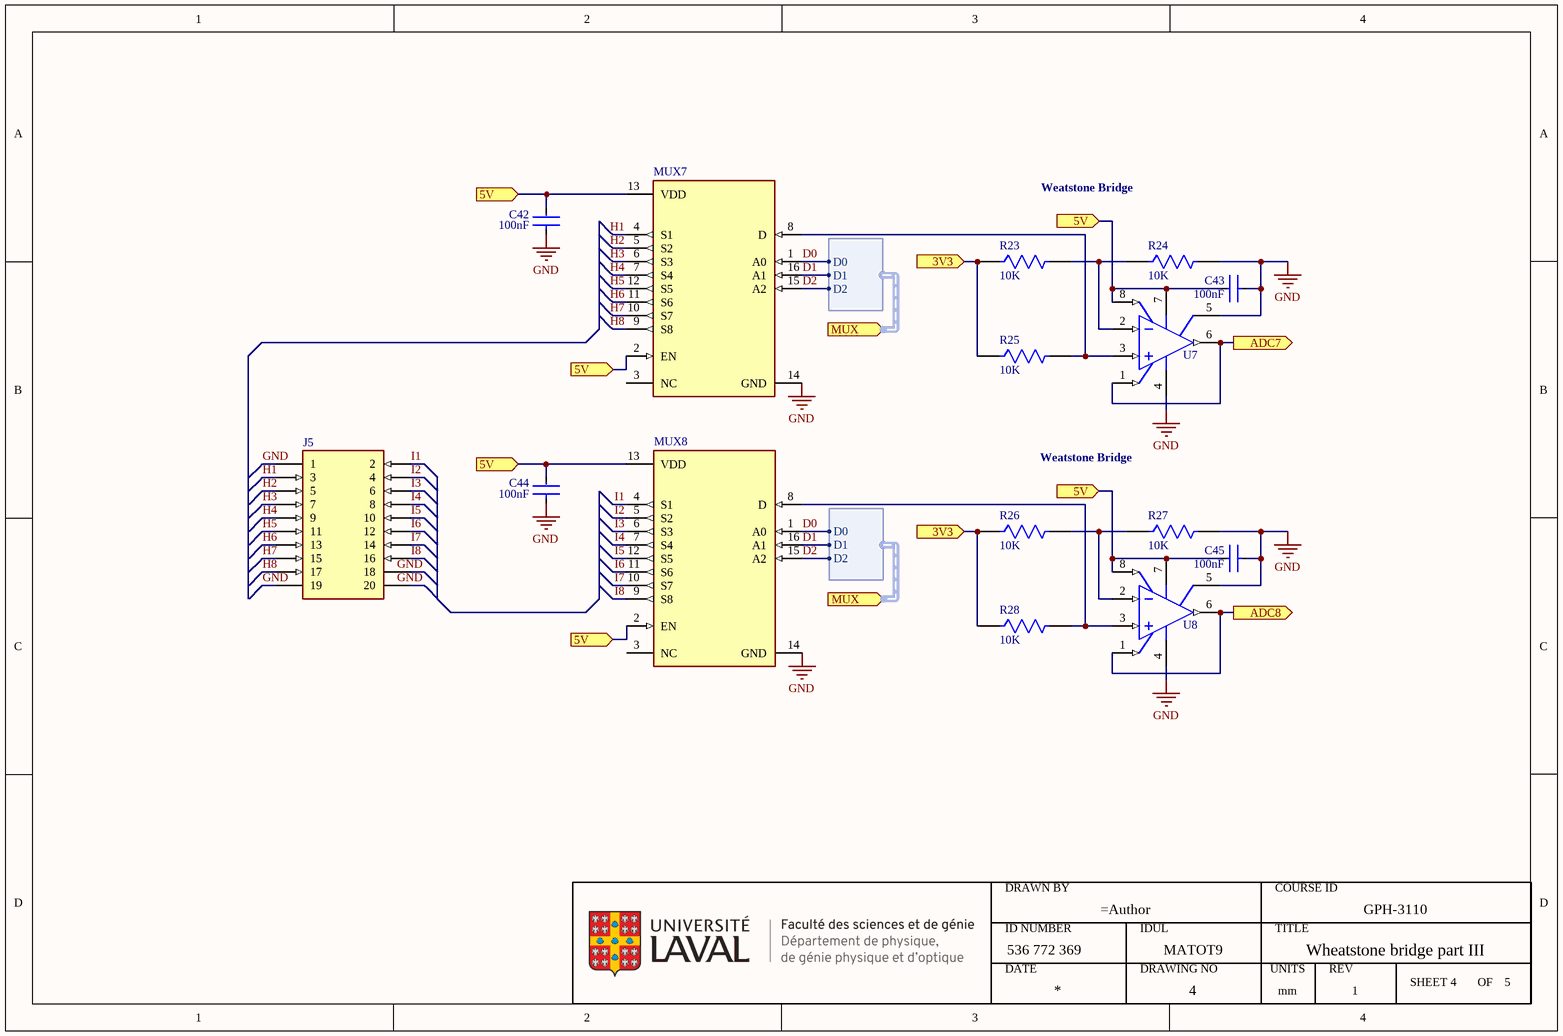
[diagram p3: Wheatstone bridge part III.SchDoc]

### Parts
*5  ULaval FSG-DPGPO  (value not drawn)  (graphical)
C42  value 100nF  [FP-CC0603-DA-IPC_B]  (hidden comment: CC0603JRX7R9BB104)
C43  value 100nF  [FP-CC0603-DA-IPC_B]  (hidden comment: CC0603JRX7R9BB104)
C44  value 100nF  [FP-CC0603-DA-IPC_B]  (hidden comment: CC0603JRX7R9BB104)
C45  value 100nF  [FP-CC0603-DA-IPC_B]  (hidden comment: CC0603JRX7R9BB104)
J5  SFC-110-T1-F-D-A  [SFC-110-T1-F-D-A-Footprint-2]  (value not drawn)
MUX7  TMUX1208PWR  [TMUX1208PWR]  (value not drawn)
MUX8  TMUX1208PWR  [TMUX1208PWR]  (value not drawn)
R23  value 10K  [FP-RT0603-IPC_B]  (hidden comment: RT0603BRD0710KL)
R24  value 10K  [FP-RT0603-IPC_B]  (hidden comment: RT0603BRD0710KL)
R25  value 10K  [FP-RT0603-IPC_B]  (hidden comment: RT0603BRD0710KL)
R26  value 10K  [FP-RT0603-IPC_B]  (hidden comment: RT0603BRD0710KL)
R27  value 10K  [FP-RT0603-IPC_B]  (hidden comment: RT0603BRD0710KL)
R28  value 10K  [FP-RT0603-IPC_B]  (hidden comment: RT0603BRD0710KL)
U7  MCP6N11-100E/SN  [MCP6N11-100E/SN]  (value not drawn)
U8  MCP6N11-100E/SN  [MCP6N11-100E/SN]  (value not drawn)

### Ports
3V3 (in), 5V (in), ADC7 (out), ADC8 (out), MUX (in, harness *)

### Harnesses
*: D0, D1, D2

### Nets
GND: C42.1 C43.1 C44.1 C45.1 J5.1 J5.18 J5.19 J5.20 MUX7.14(GND) MUX8.14(GND) R24.2 R27.2 U7.4(VSS) U7.5(VREF) U8.4(VSS) U8.5(VREF)
D0: MUX7.1(A0) MUX8.1(A0) ; port MUX.D0
D1: MUX7.16(A1) MUX8.16(A1) ; port MUX.D1
D2: MUX7.15(A2) MUX8.15(A2) ; port MUX.D2
H1: J5.3 MUX7.4(S1)
H2: J5.5 MUX7.5(S2)
H3: J5.7 MUX7.6(S3)
H4: J5.9 MUX7.7(S4)
H5: J5.11 MUX7.12(S5)
H6: J5.13 MUX7.11(S6)
H7: J5.15 MUX7.10(S7)
H8: J5.17 MUX7.9(S8)
I1: J5.2 MUX8.4(S1)
I2: J5.4 MUX8.5(S2)
I3: J5.6 MUX8.6(S3)
I4: J5.8 MUX8.7(S4)
I5: J5.10 MUX8.12(S5)
I6: J5.12 MUX8.11(S6)
I7: J5.14 MUX8.10(S7)
I8: J5.16 MUX8.9(S8)
NetADC1_1: R23.1 R25.1 R26.1 R28.1 ; port 3V3
NetADC1_9: C42.2 C43.2 C44.2 C45.2 MUX7.2(EN) MUX7.13(VDD) MUX8.2(EN) MUX8.13(VDD) U7.7(VDD) U7.8(EN/~{CAL}) U8.7(VDD) U8.8(EN/~{CAL}) ; port 5V
NetADC7_3: U7.1(VFG) U7.6(VOUT) ; port ADC7
NetADC8_3: U8.1(VFG) U8.6(VOUT) ; port ADC8
NetMUX7_8: MUX7.8(D) R25.2 U7.3(VIP)
NetMUX8_8: MUX8.8(D) R28.2 U8.3(VIP)
NetR23_2: R23.2 R24.1 U7.2(VIM)
NetR26_2: R26.2 R27.1 U8.2(VIM)

Not connected (* = marked no-connect by the designer): MUX7 3(NC); MUX8 3(NC)

### Notes on the sheet
- Weatstone Bridge
- (in symbol ULaval FSG-DPGPO) DRAWN BY; COURSE ID; ID NUMBER; IDUL; TITLE; DATE; DRAWING NO; UNITS; REV; SHEET; OF

### Library data of the parts
C42-C45 = CMP-001-00097-1: as C36 on sheet Wheatstone bridge part II; Halogen Free: Halogen Free; Depth: 0.8mm; Case/Package: 0603; Dielectric: X7R; Thickness: 0.035inch; Series: CC; Termination: SMD/SMT; Voltage Rating (DC): 50V; Max Operating Temperature: 125°C; Weight: 7.1E-05oz; Construction: Flat; Resistor Type: Ceramic; Height: 0.8mm; Length: 0.063inch; RoHS Compliant: Yes; Lead Free: Lead Free; Pins: 2; Min Operating Temperature: -55°C; Case Code (Imperial): 0603; Radiation Hardening: No; Case Code (Metric): 1608; Mounting Technology: Surface Mount; Width: 0.031inch; Packaging: Tape and Reel
J5 = CMP-002-00080-2: as J3 on sheet Wheatstone bridge part II; Insulation Color: Black; Max Operating Temperature: 125°C; Min Operating Temperature: -55°C; Insulation Material: Polymer; RoHS Compliant: Yes; Row Spacing: 0.05inch; Number of Rows: 2; Contact Shape: Square; Contact Type: Female Socket; Mounting Technology: Through Hole; Termination: Solder; Fastening Type: Pull; Contact Finish - Mating: GOLD; Color: Black; Packaging: Rail/Tube; Contact Material: Bronze; Contact Plating: Gold; Number of Positions: 20; Series: Tiger Eye™ SFC
MUX7 MUX8 = TMUX1208PWR: as MUX1 on sheet Wheatstone bridge part II; Supplier 1: Digi-Key; Supplier Part Number 1: 296-51847-1-ND; Supplier 2: Digi-Key; Supplier Part Number 2: 296-51847-6-ND; Supplier 3: Digi-Key; Supplier Part Number 3: 296-51847-2-ND; ComponentLink1Description: Datasheet; ComponentLink1URL: https://www.ti.com/lit/ds/symlink/tmux1208.pdf?HQS=dis-dk-null-digikeymode-dsf-pf-null-wwe&ts=1678139087624&ref_url=https%253A%252F%252Fwww.ti.com%252Fgeneral%252Fdocs%252Fsuppproductinfo.tsp%253FdistId%253D10%2526gotoUrl%253Dhttps%253A%252F%252Fwww.ti.com%252Flit%252Fgpn%252Ftmux1208
R23-R28 = CMP-009-00178-1: as R14 on sheet Wheatstone bridge part II; RoHS Compliant: Yes; Power Rating: 100mW; Lead Free: Lead Free; Depth: 0.8mm; Case Code (Imperial): 0603; Max Operating Temperature: 155°C; Voltage Rating: 75V; Package Quantity: 5000; Packaging: Tape and Reel; Case/Package: 0603; Height: 0.022inch; Construction: Rectangular; Min Operating Temperature: -55°C; Termination: SMD/SMT; Features: Moisture Resistant; Number of Terminations: 2; Case Code (Metric): 1608; Technology: THIN FILM; Military Standard: Not; Length: 0.063inch; Voltage Rating (DC): 75V; Temperature Coefficient: 25ppm/°C; Weight: 7.1E-05oz; Width: 0.8mm; Series: RT; Resistor Type: Thin Film
U7 U8 = CMP-014-00010-7: as U4 on sheet Wheatstone bridge part II; Mounting Technology: Surface Mount; Package Quantity: 100; Pins: 8; Width: 3.9mm; Length: 4.9mm; Case/Package: SOIC; Min Operating Temperature: -40°C; Radiation Hardening: No; RoHS Compliant: Yes; Unity Gain Bandwidth Product: 35MHz; Lead Free: Lead Free; Number of Amplifiers: 1; Max Operating Temperature: 125°C; Height: 1.25mm; Packaging: Rail/Tube; Input Offset Voltage-Max: 350uV; Reach SVHC Compliant: Yes; Supply Current: 800uA; Max Supply Current: 800uA; Power Supply Rejection Ratio (PSRR): 86dB; Number of Circuits: 1

## Sheet Processing interface.SchDoc
size A4; DrawnBy: Maxime Tousignant-Tremblay; SheetNumber: 5; SheetTotal: 5; Units: mm
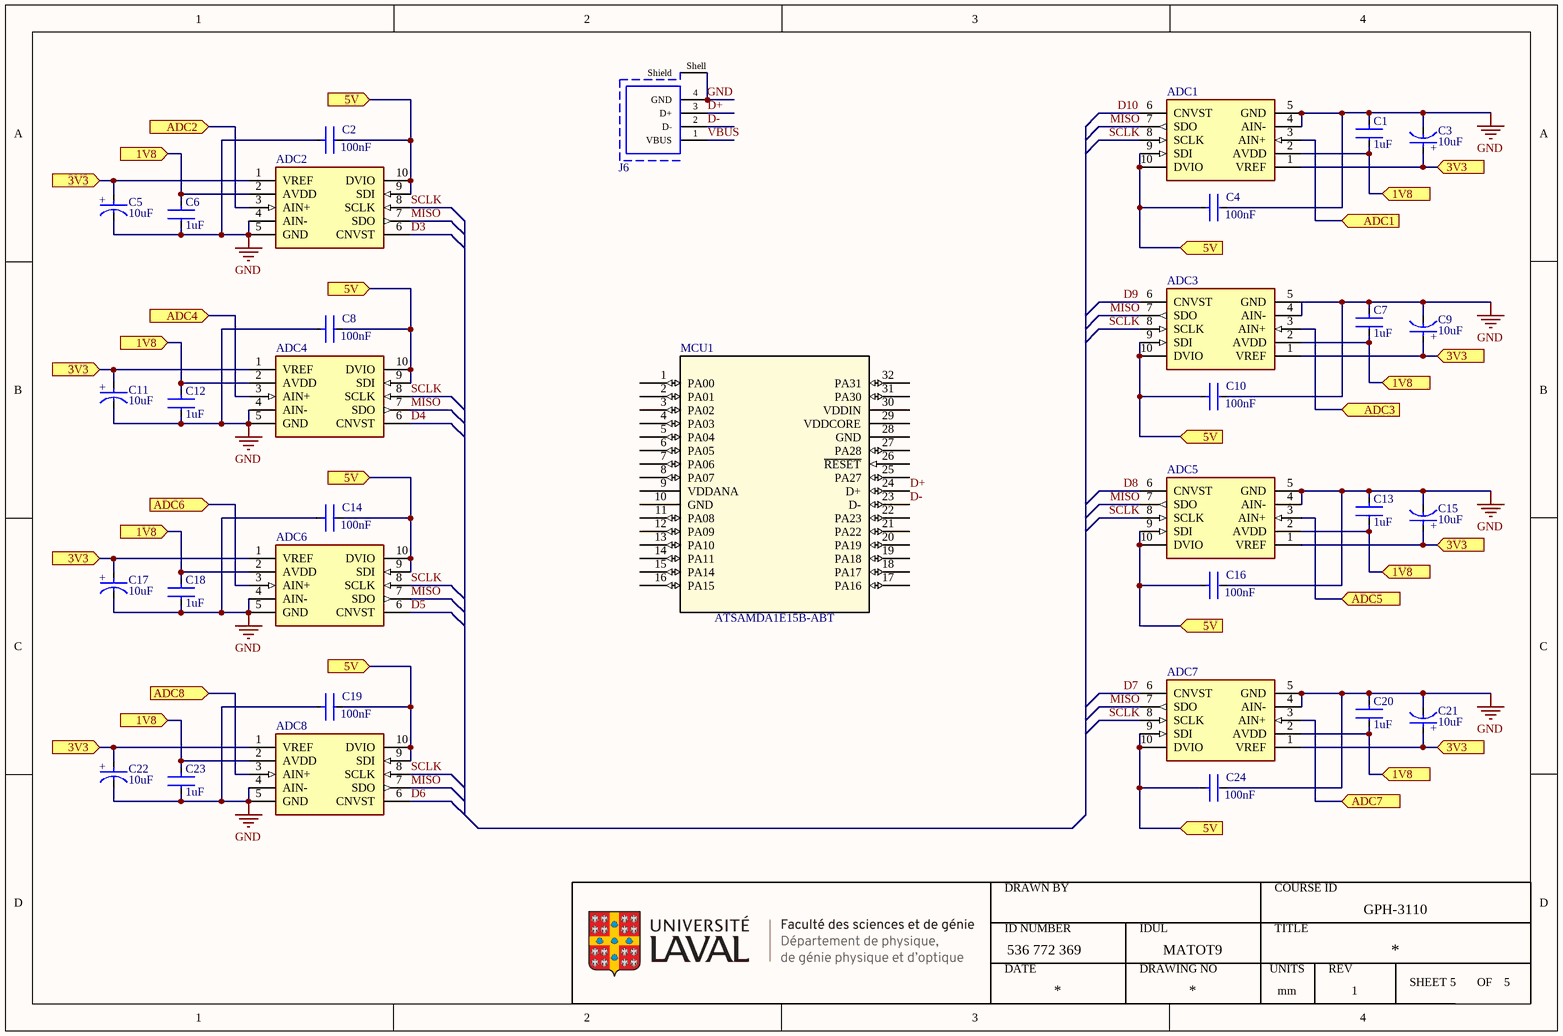
[diagram p4: Processing interface.SchDoc]

### Parts
ADC1  MCP33141-10-E/MS  [MCP33141-10-E/MS]  (value not drawn)
ADC2  MCP33141-10-E/MS  [MCP33141-10-E/MS]  (value not drawn)
ADC3  MCP33141-10-E/MS  [MCP33141-10-E/MS]  (value not drawn)
ADC4  MCP33141-10-E/MS  [MCP33141-10-E/MS]  (value not drawn)
ADC5  MCP33141-10-E/MS  [MCP33141-10-E/MS]  (value not drawn)
ADC6  MCP33141-10-E/MS  [MCP33141-10-E/MS]  (value not drawn)
ADC7  MCP33141-10-E/MS  [MCP33141-10-E/MS]  (value not drawn)
ADC8  MCP33141-10-E/MS  [MCP33141-10-E/MS]  (value not drawn)
C1  value 1uF  [FP-CC0603-DA-IPC_B]  (hidden comment: CC0603KPX7R7BB105)
C2  value 100nF  [FP-CC0603-DA-IPC_B]  (hidden comment: CC0603JRX7R9BB104)
C3  value 10uF  [FP-293D-B-MFG]  (hidden comment: 293D106X9016B2TE3)
C4  value 100nF  [FP-CC0603-DA-IPC_B]  (hidden comment: CC0603JRX7R9BB104)
C5  value 10uF  [FP-293D-B-MFG]  (hidden comment: 293D106X9016B2TE3)
C6  value 1uF  [FP-CC0603-DA-IPC_B]  (hidden comment: CC0603KPX7R7BB105)
C7  value 1uF  [FP-CC0603-DA-IPC_B]  (hidden comment: CC0603KPX7R7BB105)
C8  value 100nF  [FP-CC0603-DA-IPC_B]  (hidden comment: CC0603JRX7R9BB104)
C9  value 10uF  [FP-293D-B-MFG]  (hidden comment: 293D106X9016B2TE3)
C10  value 100nF  [FP-CC0603-DA-IPC_B]  (hidden comment: CC0603JRX7R9BB104)
C11  value 10uF  [FP-293D-B-MFG]  (hidden comment: 293D106X9016B2TE3)
C12  value 1uF  [FP-CC0603-DA-IPC_B]  (hidden comment: CC0603KPX7R7BB105)
C13  value 1uF  [FP-CC0603-DA-IPC_B]  (hidden comment: CC0603KPX7R7BB105)
C14  value 100nF  [FP-CC0603-DA-IPC_B]  (hidden comment: CC0603JRX7R9BB104)
C15  value 10uF  [FP-293D-B-MFG]  (hidden comment: 293D106X9016B2TE3)
C16  value 100nF  [FP-CC0603-DA-IPC_B]  (hidden comment: CC0603JRX7R9BB104)
C17  value 10uF  [FP-293D-B-MFG]  (hidden comment: 293D106X9016B2TE3)
C18  value 1uF  [FP-CC0603-DA-IPC_B]  (hidden comment: CC0603KPX7R7BB105)
C19  value 100nF  [FP-CC0603-DA-IPC_B]  (hidden comment: CC0603JRX7R9BB104)
C20  value 1uF  [FP-CC0603-DA-IPC_B]  (hidden comment: CC0603KPX7R7BB105)
C21  value 10uF  [FP-293D-B-MFG]  (hidden comment: 293D106X9016B2TE3)
C22  value 10uF  [FP-293D-B-MFG]  (hidden comment: 293D106X9016B2TE3)
C23  value 1uF  [FP-CC0603-DA-IPC_B]  (hidden comment: CC0603KPX7R7BB105)
C24  value 100nF  [FP-CC0603-DA-IPC_B]  (hidden comment: CC0603JRX7R9BB104)
J6  61400413321  [61400413321]  (value not drawn)
MCU1  ATSAMDA1E15B-ABT  [TQFP32_MC_MCH-M]

### Ports
1V8 (in), 3V3 (in), 5V (in), ADC1 (in), ADC2 (in), ADC3 (in), ADC4 (in), ADC5 (in), ADC6 (in), ADC7 (in), ADC8 (in)

### Nets
GND: ADC1.4(AIN-) ADC1.5(GND) ADC2.4(AIN-) ADC2.5(GND) ADC3.4(AIN-) ADC3.5(GND) ADC4.4(AIN-) ADC4.5(GND) ADC5.4(AIN-) ADC5.5(GND) ADC6.4(AIN-) ADC6.5(GND) ADC7.4(AIN-) ADC7.5(GND) ADC8.4(AIN-) ADC8.5(GND) C1.1 C2.1 C3.1(C) C4.2 C5.1(C) C6.2 C7.1 C8.1 C9.1(C) C10.2 C11.1(C) C12.2 C13.1 C14.1 C15.1(C) C16.2 C17.1(C) C18.2 C19.1 C20.1 C21.1(C) C22.1(C) C23.2 C24.2 J6.4(GND) J6.Shell(Shield)
D3: ADC2.6(CNVST)
D4: ADC4.6(CNVST)
D5: ADC6.6(CNVST)
D6: ADC8.6(CNVST)
D7: ADC7.6(CNVST)
D8: ADC5.6(CNVST)
D9: ADC3.6(CNVST)
D10: ADC1.6(CNVST)
D+: J6.3(D+) MCU1.24(D+)
D-: J6.2(D-) MCU1.23(D-)
MISO: ADC1.7(SDO) ADC2.7(SDO) ADC3.7(SDO) ADC4.7(SDO) ADC5.7(SDO) ADC6.7(SDO) ADC7.7(SDO) ADC8.7(SDO)
SCLK: ADC1.8(SCLK) ADC2.8(SCLK) ADC3.8(SCLK) ADC4.8(SCLK) ADC5.8(SCLK) ADC6.8(SCLK) ADC7.8(SCLK) ADC8.8(SCLK)
VBUS: J6.1(VBUS)
NetADC1_1: ADC1.1(VREF) ADC2.1(VREF) ADC3.1(VREF) ADC4.1(VREF) ADC5.1(VREF) ADC6.1(VREF) ADC7.1(VREF) ADC8.1(VREF) C3.2(A) C5.2(A) C9.2(A) C11.2(A) C15.2(A) C17.2(A) C21.2(A) C22.2(A) ; port 3V3
NetADC1_2: ADC1.2(AVDD) ADC2.2(AVDD) ADC3.2(AVDD) ADC4.2(AVDD) ADC5.2(AVDD) ADC6.2(AVDD) ADC7.2(AVDD) ADC8.2(AVDD) C1.2 C6.1 C7.2 C12.1 C13.2 C18.1 C20.2 C23.1 ; port 1V8
NetADC1_3: ADC1.3(AIN+) ; port ADC1
NetADC1_9: ADC1.9(SDI) ADC1.10(DVIO) ADC2.9(SDI) ADC2.10(DVIO) ADC3.9(SDI) ADC3.10(DVIO) ADC4.9(SDI) ADC4.10(DVIO) ADC5.9(SDI) ADC5.10(DVIO) ADC6.9(SDI) ADC6.10(DVIO) ADC7.9(SDI) ADC7.10(DVIO) ADC8.9(SDI) ADC8.10(DVIO) C2.2 C4.1 C8.2 C10.1 C14.2 C16.1 C19.2 C24.1 ; port 5V
NetADC2_3: ADC2.3(AIN+) ; port ADC2
NetADC3_3: ADC3.3(AIN+) ; port ADC3
NetADC4_3: ADC4.3(AIN+) ; port ADC4
NetADC5_3: ADC5.3(AIN+) ; port ADC5
NetADC6_3: ADC6.3(AIN+) ; port ADC6
NetADC7_3: ADC7.3(AIN+) ; port ADC7
NetADC8_3: ADC8.3(AIN+) ; port ADC8

Not connected (* = marked no-connect by the designer): MCU1 1(PA00) 2(PA01) 3(PA02) 4(PA03) 5(PA04) 6(PA05) 7(PA06) 8(PA07) 9(VDDANA) 10(GND) 11(PA08) 12(PA09) 13(PA10) 14(PA11) 15(PA14) 16(PA15) 17(PA16) 18(PA17) 19(PA18) 20(PA19) 21(PA22) 22(PA23) 25(PA27) 26(~{RESET}) 27(PA28) 28(GND) 29(VDDCORE) 30(VDDIN) 31(PA30) 32(PA31)

### Notes on the sheet
- DRAWN BY
- COURSE ID
- ID NUMBER
- DATE
- IDUL
- DRAWING NO
- TITLE
- UNITS
- REV
- SHEET
- OF
- (in symbol CMP-001-00090-1) +

### Library data of the parts
ADC1-ADC8 = CMP-020-00028-10: ADC Single SAR 1Msps 12-bit Serial Microwire/SPI 10-Pin MSOP Tray; Resolution: 12 Bits; Sampling rate: 1M; Data Interface: SPI; Architecture: SAR
C1 C6 C7 C12 C13 C18 C20 C23 = CMP-001-00101-1: 0603 1 uF 16 V ±10 % Tolerance X7R SMT Multilayer Ceramic Capacitor; Tolerance: 10%; Voltage Rating (DC): 16V; Construction: Flat; Case Code (Imperial): 0603; Height: 0.8mm; Max Operating Temperature: 125°C; Termination: SMD/SMT; Mounting Technology: Surface Mount; Packaging: Tape and Reel; RoHS Compliant: Yes; Dielectric: X7R; Length: 1.6mm; Halogen Free: Halogen Free; Min Operating Temperature: -55°C; Case Code (Metric): 1608; Lead Free: Lead Free; Radiation Hardening: No; Case/Package: 0603; Depth: 0.8mm; Weight: 7.1E-05oz; Resistor Type: Ceramic
C2 C4 C8 C10 C14 C16 C19 C24 = CMP-001-00097-1: as C36 on sheet Wheatstone bridge part II; Halogen Free: Halogen Free; Depth: 0.8mm; Case/Package: 0603; Dielectric: X7R; Thickness: 0.035inch; Series: CC; Termination: SMD/SMT; Voltage Rating (DC): 50V; Max Operating Temperature: 125°C; Weight: 7.1E-05oz; Construction: Flat; Resistor Type: Ceramic; Height: 0.8mm; Length: 0.063inch; RoHS Compliant: Yes; Lead Free: Lead Free; Pins: 2; Min Operating Temperature: -55°C; Case Code (Imperial): 0603; Radiation Hardening: No; Case Code (Metric): 1608; Mounting Technology: Surface Mount; Width: 0.031inch; Packaging: Tape and Reel
C3 C5 C9 C11 C15 C17 C21 C22 = CMP-001-00090-1: Cap Tant Solid 10uF 16V B CASE 10% (3.5 X 2.8 X 1.9mm) Inward L SMD 3528-21 2 Ohm 125C T/R; ESR (Equivalent Series Resistance): 2R; Ripple Current: 160mA; Dielectric Material: Tantalum; Q Factor: 6; Polarity: Polar; Dissipation Factor: 6%; Leakage Current: 1.6uA; Termination: SMD/SMT; Package Quantity: 2000; RoHS Compliant: Yes; Min Operating Temperature: -55°C; Lead Free: Lead Free; Length: 3.5mm; Tolerance: 10%; Height: 1.9mm; Construction: Flat; Voltage: 16V; Height - Seated (Max): 0.083inch; Voltage Rating (DC): 16V; Features: General Purpose; Packaging: Tape and Reel; Voltage Rating: 16V; Case Code (Imperial): 1411; Case/Package: 1411; Width: 1.9mm; Max Operating Temperature: 125°C; Mounting Technology: Surface Mount,PCB; Case Code (Metric): 3528; Series: TANTAMOUNT®, 293D; Depth: 2.8mm; Radiation Hardening: No
J6 = CMP-002-00083-1: Straight PCB Mount Mount Female Type B USB Connector; 30 V ac; 1.5A; Voltage Rating: 30V; Number of Positions: 4; Mating Cycles: 1500; Insulation Resistance: 1GR; Current Rating: 1A; Shielding: Shielded; Number of Ports: 1; Gender: Receptacle; USB Standard: USB 2.0; Width: 19.15mm; Flammability Rating: UL94 V-0; Mounting Technology: Through Hole,Vertical,PCB; Features: Shielded; Number of Contacts: 4; Packaging: Tray; Insulation Color: White; Min Operating Temperature: -40°C; Connector Type: USB; Lead Free: Lead Free; Length: 14.8mm; Contact Plating: Gold; Orientation: Vertical; Contact Material: Copper Alloy; Series: WR-COM; Termination: Solder; Max Operating Temperature: 105°C; Package Quantity: 100; Color: White
MCU1 = ATSAMDA1E15B-ABT: ARM® Cortex®-M0+ SAM DA1, Functional Safety (FuSa) Microcontroller IC 32-Bit Single-Core 48MHz 32KB (32K x 8) FLASH 32-TQFP (7x7); Mfr_Name: Microchip; Copyright: Copyright (C) 2023 Ultra Librarian. All rights reserved.; Manufacturer_Part_Number: ATSAMDA1E15B-ABT; RefDes: RefDes; Type: DEV; Supplier 1: Mouser; Supplier Part Number 1: 556-ATSAMDA1E15B-ABT

## Nets that join several sheets
GND: Power Supply Unit (18 pins), Wheatstone bridge part II (26 pins), Wheatstone bridge part I (22 pins), Wheatstone bridge part III (16 pins), Processing interface (42 pins)
C1: Wheatstone bridge part II (J3.3), Wheatstone bridge part I (MUX6.4)
C2: Wheatstone bridge part II (J3.5), Wheatstone bridge part I (MUX6.5)
C3: Wheatstone bridge part II (J3.7), Wheatstone bridge part I (MUX6.6)
C4: Wheatstone bridge part II (J3.9), Wheatstone bridge part I (MUX6.7)
C5: Wheatstone bridge part II (J3.11), Wheatstone bridge part I (MUX6.12)
C6: Wheatstone bridge part II (J3.13), Wheatstone bridge part I (MUX6.11)
C7: Wheatstone bridge part II (J3.15), Wheatstone bridge part I (MUX6.10)
C8: Wheatstone bridge part II (J3.17), Wheatstone bridge part I (MUX6.9)
D0: Wheatstone bridge part II (MUX1.1 MUX2.1 MUX3.1), Wheatstone bridge part I (MUX4.1 MUX5.1 MUX6.1), Wheatstone bridge part III (MUX7.1 MUX8.1)
D1: Wheatstone bridge part II (MUX1.16 MUX2.16 MUX3.16), Wheatstone bridge part I (MUX4.16 MUX5.16 MUX6.16), Wheatstone bridge part III (MUX7.16 MUX8.16)
D2: Wheatstone bridge part II (MUX1.15 MUX2.15 MUX3.15), Wheatstone bridge part I (MUX4.15 MUX5.15 MUX6.15), Wheatstone bridge part III (MUX7.15 MUX8.15)
NetADC1_1: Power Supply Unit (VREF1.1), Wheatstone bridge part II (6 pins), Wheatstone bridge part I (6 pins), Wheatstone bridge part III (R23.1 R25.1 R26.1 R28.1), Processing interface (16 pins)
NetADC1_2: Power Supply Unit (VREF2.1), Processing interface (16 pins)
NetADC1_3: Wheatstone bridge part I (U1.1 U1.6), Processing interface (ADC1.3)
NetADC1_9: Power Supply Unit (8 pins), Wheatstone bridge part II (18 pins), Wheatstone bridge part I (18 pins), Wheatstone bridge part III (12 pins), Processing interface (24 pins)
NetADC2_3: Wheatstone bridge part I (U2.1 U2.6), Processing interface (ADC2.3)
NetADC3_3: Wheatstone bridge part I (U3.1 U3.6), Processing interface (ADC3.3)
NetADC4_3: Wheatstone bridge part II (U4.1 U4.6), Processing interface (ADC4.3)
NetADC5_3: Wheatstone bridge part II (U5.1 U5.6), Processing interface (ADC5.3)
NetADC6_3: Wheatstone bridge part II (U6.1 U6.6), Processing interface (ADC6.3)
NetADC7_3: Wheatstone bridge part III (U7.1 U7.6), Processing interface (ADC7.3)
NetADC8_3: Wheatstone bridge part III (U8.1 U8.6), Processing interface (ADC8.3)